# EAGLE design Group11 (EAGLE 9.2.0)
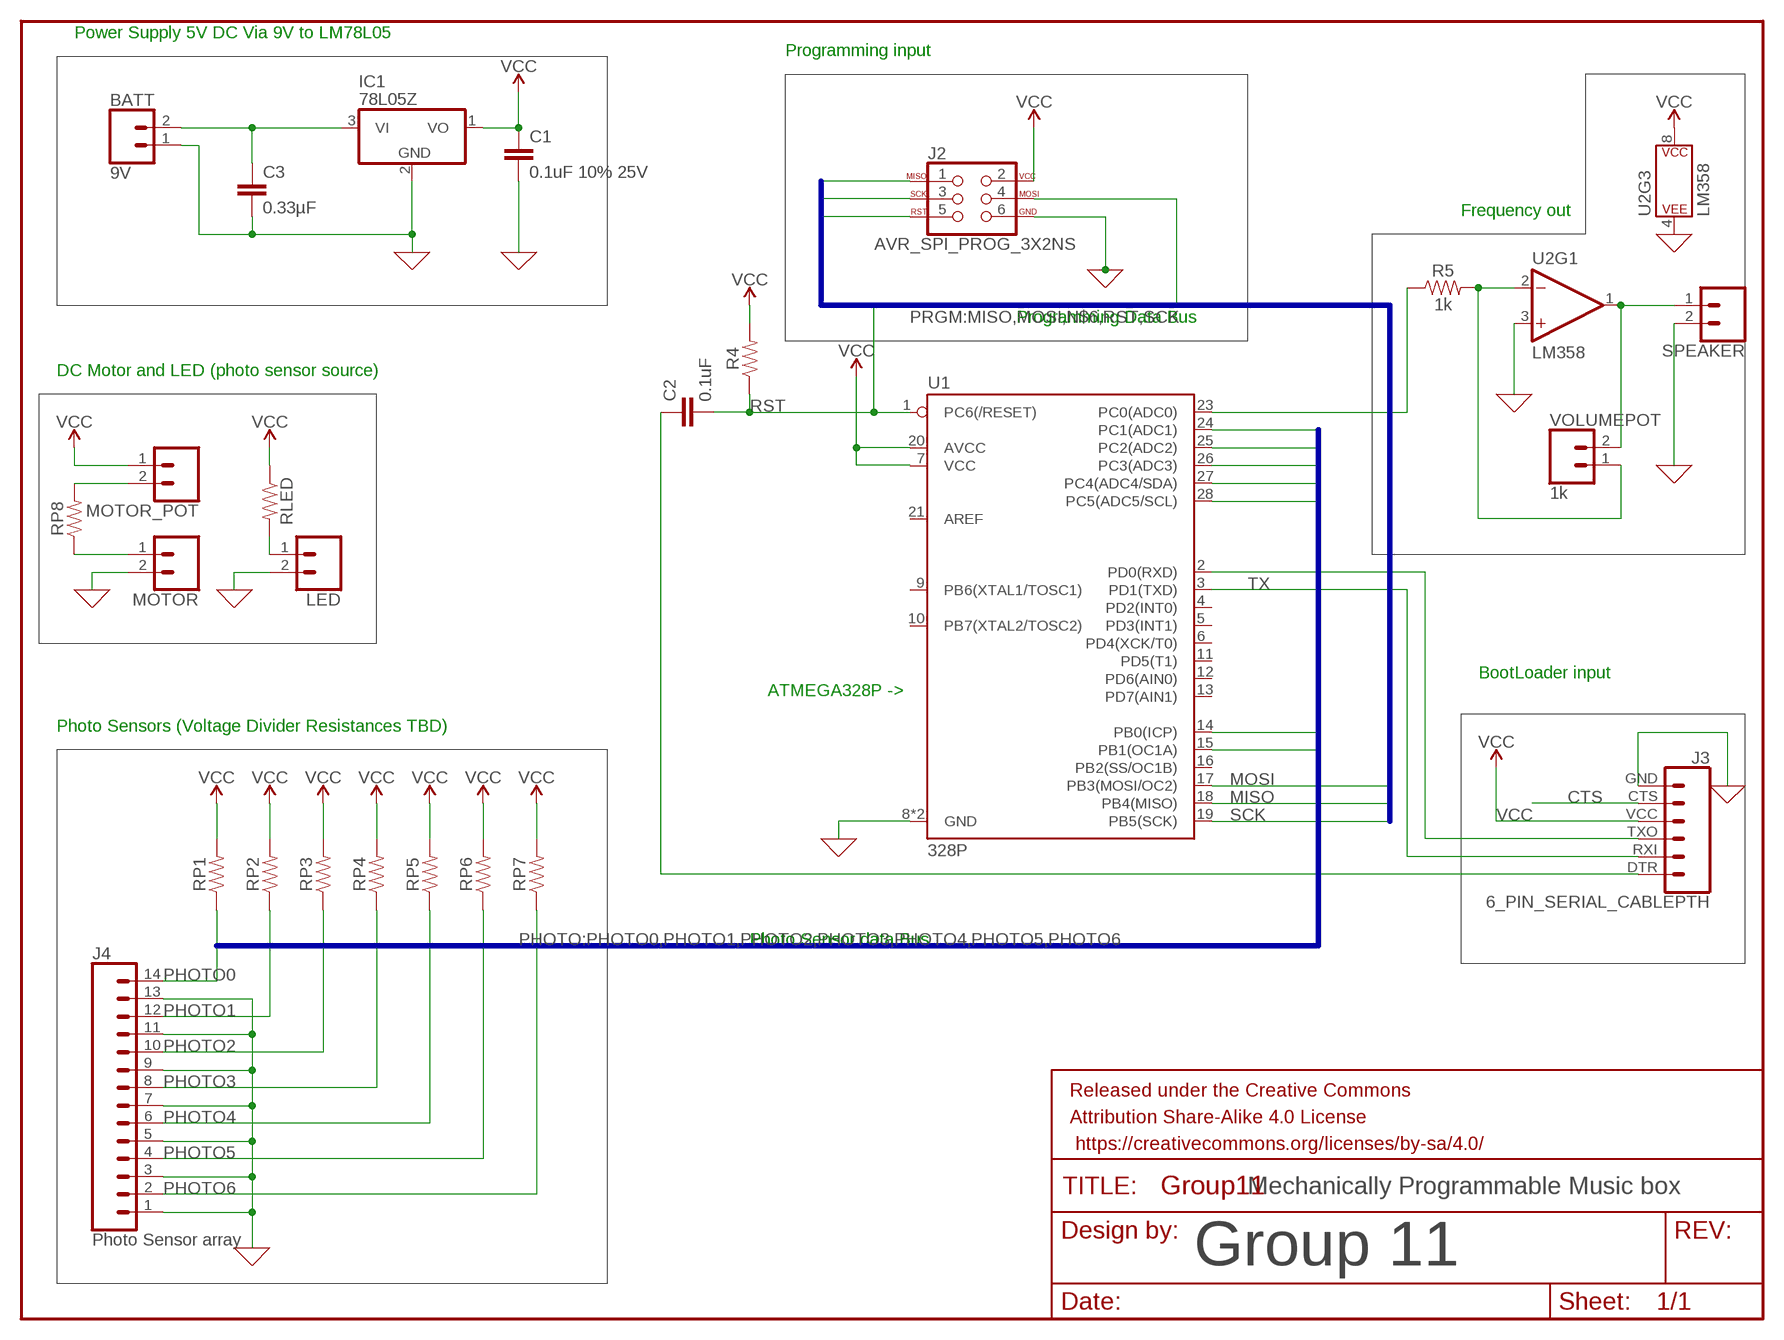
[diagram p0: schematic, sheet 1]

## Parts
BATT  9V  CONN_02  [1X02]
C1  0.1uF 10% 25V  0.1UF-0603-25V-(+80/-20%)  [0603]
C2  0.1uF  0.1UF-0603-25V-(+80/-20%)  [0603]
C3  0.33µF  0.33UF/330NF-0805-50V-10%  [0805]
FRAME1  FRAME-LETTER  [CREATIVE_COMMONS]
IC1  78L05Z  [TO92]
J2  AVR_SPI_PROG_3X2NS  [2X3-NS]
J3  6_PIN_SERIAL_CABLEPTH  [FTDI_BASIC]
J4  Photo Sensor array  CONN_14  [1X14]
LED  CONN_02  [1X02]
MOTOR  CONN_02  [1X02]
MOTOR_POT  CONN_02  [1X02]
R4  RESISTOR0805  [0805]
R5  1k  1KOHM-0603-1/10W-1%  [0603]
RLED  RESISTOR0603  [0603]
RP1  RESISTOR0603  [0603]
RP2  RESISTOR0603  [0603]
RP3  RESISTOR0603  [0603]
RP4  RESISTOR0603  [0603]
RP5  RESISTOR0603  [0603]
RP6  RESISTOR0603  [0603]
RP7  RESISTOR0603  [0603]
RP8  RESISTOR0603  [0603]
SPEAKER  CONN_02  [1X02]
U1  328P  ATMEGA328P_PDIP  [DIP28]
U2  LM358  [DIP08]
VOLUMEPOT  1k  CONN_02  [1X02]

## Nets
0: BATT.1 C1.2 C3.2 IC1.2(GND) J2.6 J3.GND J4.1 J4.3 J4.5 J4.7 J4.9 J4.11 J4.13 LED.2 MOTOR.2 SPEAKER.2 U1.8(GND) U1.22(GND) U2.3(+IN) U2.4(P$V-) ; supply symbol labelled GND
CTS: J3.CTS
MISO: J2.1 U1.18(PB4(MISO))
MOSI: J2.4 U1.17(PB3(MOSI/OC2))
N$1: R5.1 U1.23(PC0(ADC0))
N$2: MOTOR_POT.2 RP8.2
N$3: LED.1 RLED.2
N$4: J3.TXO U1.2(PD0(RXD))
N$5: C2.1 J3.DTR
N$7: MOTOR.1 RP8.1
N$8: R5.2 U2.2(-IN) VOLUMEPOT.1
N$9: SPEAKER.1 U2.1(OUT) VOLUMEPOT.2
N$15: BATT.2 C3.1 IC1.3(VI)
PHOTO0: J4.14 RP1.1 U1.24(PC1(ADC1))
PHOTO1: J4.12 RP2.1 U1.25(PC2(ADC2))
PHOTO2: J4.10 RP3.1 U1.26(PC3(ADC3))
PHOTO3: J4.8 RP4.1 U1.27(PC4(ADC4/SDA))
PHOTO4: J4.6 RP5.1 U1.28(PC5(ADC5/SCL))
PHOTO5: J4.4 RP6.1 U1.14(PB0(ICP))
PHOTO6: J4.2 RP7.1 U1.15(PB1(OC1A))
RST: C2.2 J2.5 R4.1 U1.1(PC6(/RESET))
SCK: J2.3 U1.19(PB5(SCK))
TX: J3.RXI U1.3(PD1(TXD))
VCC: C1.1 IC1.1(VO) J2.2 J3.VCC MOTOR_POT.1 R4.2 RLED.1 RP1.2 RP2.2 RP3.2 RP4.2 RP5.2 RP6.2 RP7.2 U1.7(VCC) U1.20(AVCC) U2.8(P$V+)
Unconnected: U1.4(PD2(INT0)) U1.5(PD3(INT1)) U1.6(PD4(XCK/T0)) U1.9(PB6(XTAL1/TOSC1)) U1.10(PB7(XTAL2/TOSC2)) U1.11(PD5(T1)) U1.12(PD6(AIN0)) U1.13(PD7(AIN1)) U1.16(PB2(SS/OC1B)) U1.21(AREF) U2.5(+IN) U2.6(-IN) U2.7(OUT)

## Buses
PHOTO:PHOTO0,PHOTO1,PHOTO2,PHOTO3,PHOTO4,PHOTO5,PHOTO6
PRGM:MISO,MOSI,N$6,RST,SCK

## Notes on the sheet
- Power Supply 5V DC Via 9V to LM78L05
- Programming input
- Frequency out
- Programming Data Bus
- DC Motor and LED (photo sensor source)
- BootLoader input
- ATMEGA328P ->
- Photo Sensors (Voltage Divider Resistances TBD)
- Photo Sensor data Bus
- Mechanically Programmable Music box
- Group 11

## Library data of the parts
BATT LED MOTOR MOTOR_POT SPEAKER VOLUMEPOT = SparkFun-Connectors:CONN_02: Multi connection point. Often used as Generic Header-pin footprint for 0.1 inch spaced/style header connections On any of the 0.1 inch spaced packages, you can populate with these: Break Away Headers - Straight <https://www.sparkfun.com/products/116> (PRT-00116) Break Away Male Headers - Right Angle <https://www.sparkfun.com/products/553> (PRT-00553) Female Headers <https://www.sparkfun.com/products/115> (PRT-00115) Break Away Headers - Machine Pin <https://www.sparkfun.com/products/117> (PRT-00117) Break Away Female Headers - Swiss Machine Pin <https://www.sparkfun.com/products/743> (PRT-00743) For SCREWTERMINALS and SPRING TERMINALS visit here: Screw Terimnals on SparkFun.com <https://www.sparkfun.com/search/results?term=Screw+Terminals> (5mm/3.5mm/2.54mm spacing) This device is also useful as a general connection point to wire up your design to another part of your project. Our various solder wires solder well into these plated through hole pads. Hook-Up Wire - Assortment (Stranded, 22 AWG) <https://www.sparkfun.com/products/11375> (PRT-11375) Hook-Up Wire - Assortment (Solid Core, 22 AWG) <https://www.sparkfun.com/products/11367> (PRT-11367) View the entire wire category on our website here <https://www.sparkfun.com/categories/141> Special notes: Molex polarized connector foot print use with: PRT-08233 with associated crimp pins and housings. 2.54_SCREWTERM for use with PRT-10571. 3.5mm Screw Terminal footprints for PRT-08084 5mm Screw Terminal footprints for use with PRT-08432
C1 = SparkFun-Capacitors:0.1UF: 0.1µF ceramic capacitors A capacitor is a passive two-terminal electrical component used to store electrical energy temporarily in an electric field.; PROD_ID: CAP-00810; VALUE: 0.1uF
C2 = SparkFun-Capacitors:0.1UF: 0.1µF ceramic capacitors A capacitor is a passive two-terminal electrical component used to store electrical energy temporarily in an electric field.; PROD_ID: CAP-00810
C3 = SparkFun-Capacitors:0.33UF/330NF: 0.33µF/330nF ceramic capacitors A capacitor is a passive two-terminal electrical component used to store electrical energy temporarily in an electric field.; PROD_ID: CAP-08469
FRAME1 = SparkFun-Aesthetics:FRAME-LETTER: Schematic Frame - Letter Standard 8.5x11 US Letter frame
IC1 = linear:78*: Positive VOLTAGE REGULATOR Source: http://cache.national.com/ds/LM/LM78L05.pdf http://www.fairchildsemi.com/ds/LM/LM7805.pdf
J2 = SparkFun-Connectors:AVR_SPI_PROG_3X2: AVR ISP 6 Pin This is the reduced ISP connector for AVR programming. Common on Arduino. This footprint will take up less PCB space and can be used with a 10-pin to 6-pin adapter such as SKU: BOB-08508 **Special note about "TEST_POINT" package. The stop mask is on the top side, so if you want your programming test points to be on the bottom of your board, make sure to place this package on the bottom side of the board. This also ensure that the orientation to program from the bottom side will be correct. SparkFun Products: SparkFun ISP Pogo Adapter <https://www.sparkfun.com/products/11591> - NS Tiny AVR Programmer <https://www.sparkfun.com/products/11801> -PTH
J3 = SparkFun-Connectors:6_PIN_SERIAL_CABLE: 6-pin header connection for use with the "FTDI BASIC" pinout - CABLE SIDE. Also known as "Arduino Serial Program Header". This is used on a design to provide a 6-pin connection point for serial communication usually from a USB cable (D+/D-) to these headers (RX/TX). It also has the remaining pins necessary for programming in the Arduino evironment (DTR, GND, and sometimes VCC). Note, this device has "CABLE" in the name. It is intended to be used on a design that usually lives on the end of your USB cable and prvides the converter chip (FTDI232 or FTDI231x) to commnicate serial RX/TX. The "sister" device, named "TARGET" is inteneded to be used on a design that contains a target micro-controller that you wish to program. You can populate with some of these: Female Headers <https://www.sparkfun.com/products/115> (PRT-00115) For reference (or to suit your programming needs) check out these designs: SparkFun FTDI Basic Breakout - 5V <https://www.sparkfun.com/products/9716> (DEV-09716) SparkFun FTDI Basic Breakout - 3.3V <https://www.sparkfun.com/products/9873> (DEV-09873) SparkFun FTDI SmartBasic <https://www.sparkfun.com/products/12935> (DEV-12935) SparkFun Beefy 3 - FTDI Basic Breakout <https://www.sparkfun.com/products/13746> (DEV-13746)
J4 = SparkFun-Connectors:CONN_14: Multi connection point. Often used as Generic Header-pin footprint for 0.1 inch spaced/style header connections On any of the 0.1 inch spaced packages, you can populate with these: Break Away Headers - Straight <https://www.sparkfun.com/products/116> (PRT-00116) Break Away Male Headers - Right Angle <https://www.sparkfun.com/products/553> (PRT-00553) Female Headers <https://www.sparkfun.com/products/115> (PRT-00115) Break Away Headers - Machine Pin <https://www.sparkfun.com/products/117> (PRT-00117) Break Away Female Headers - Swiss Machine Pin <https://www.sparkfun.com/products/743> (PRT-00743) For SCREWTERMINALS and SPRING TERMINALS visit here: Screw Terimnals on SparkFun.com <https://www.sparkfun.com/search/results?term=Screw+Terminals> (5mm/3.5mm/2.54mm spacing) This device is also useful as a general connection point to wire up your design to another part of your project. Our various solder wires solder well into these plated through hole pads. Hook-Up Wire - Assortment (Stranded, 22 AWG) <https://www.sparkfun.com/products/11375> (PRT-11375) Hook-Up Wire - Assortment (Solid Core, 22 AWG) <https://www.sparkfun.com/products/11367> (PRT-11367) View the entire wire category on our website here <https://www.sparkfun.com/categories/141> Special notes: Molex polarized connector foot print use with SKU : PRT-08231 with associated crimp pins and housings. 1MM SMD Version SKU: PRT-10208 NOTES ON THE VARIANTS LOCK and LOCK_LONGPADS... This footprint was designed to help hold the alignment of a through-hole component (i.e. 6-pin header) while soldering it into place. You may notice that each hole has been shifted either up or down by 0.005 of an inch from it's more standard position (which is a perfectly straight line). This slight alteration caused the pins (the squares in the middle) to touch the edges of the holes. Because they are alternating, it causes a "brace" to hold the component in place. 0.005 has proven to be the perfect amount of "off-center" position when using our standard breakaway headers. Although looks a little odd when you look at the bare footprint, once you have a header in there, the alteration is very hard to notice. Also,if you push a header all the way into place, it is covered up entirely on the bottom side.
R4 RLED RP1-RP8 = SparkFun-Resistors:RESISTOR: Generic Resistor Package
R5 = SparkFun-Resistors:1KOHM: 1kΩ resistor A resistor is a passive two-terminal electrical component that implements electrical resistance as a circuit element. Resistors act to reduce current flow, and, at the same time, act to lower voltage levels within circuits. - Wikipedia; PROD_ID: RES-07856
U1 = SparkFun-IC-Microcontroller:ATMEGA328P_PDIP: Atmel 328P Through hole ATMEGA328P uC used in the Arduino 32kb flash, 1k EEPROM, 2k SRAM Datasheet <http://www.sparkfun.com/datasheets/Components/SMD/ATMega328.pdf> SparkFun Products Storefront component: AVR 28 Pin 20MHz 32K 6A/D - ATMega328P <https://www.sparkfun.com/products/9061> (COM-09061) SparkFun Simon Says - Through-Hole Soldering Kit <https://www.sparkfun.com/products/10547> (KIT-10547) SparkFun Learn to Solder - Simon Says <https://www.sparkfun.com/products/13708> (KIT-13708) SparkFun BigTime Watch Kit <https://www.sparkfun.com/products/11734> (KIT-11734) SparkFun ClockIt <https://www.sparkfun.com/products/10930> (KIT-10930) SparkFun Serial Enabled LCD Kit <https://www.sparkfun.com/products/10097> (LCD-10097) SparkFun Simon Tilts - Through Hole Soldering Kit <https://www.sparkfun.com/products/12634> (KIT-12634) SparkFun Frequency Counter Kit <https://www.sparkfun.com/products/10140> (KIT-10140) FabFM Radio Kit <https://www.sparkfun.com/products/11043> (KIT-11043) SparkFun Binary Blaster Kit <https://www.sparkfun.com/products/12037> (KIT-12037) SparkFun Metro-Gnome <https://www.sparkfun.com/products/9236> (KIT-09236) ATmega328 with Arduino Optiboot (Uno) <https://www.sparkfun.com/products/10524> (DEV-10524); PROD_ID: IC-09136
U2 = SparkFun-IC-Amplifiers:LM358: LM358 Jellybean op-amp Datasheet <http://www.sparkfun.com/datasheets/Components/General/LM358.pdf> SparkFun Products Op-Amp (Thru-Hole) - LM358 <https://www.sparkfun.com/products/9456> (COM-09456); PROD_ID: IC-09172

## Board
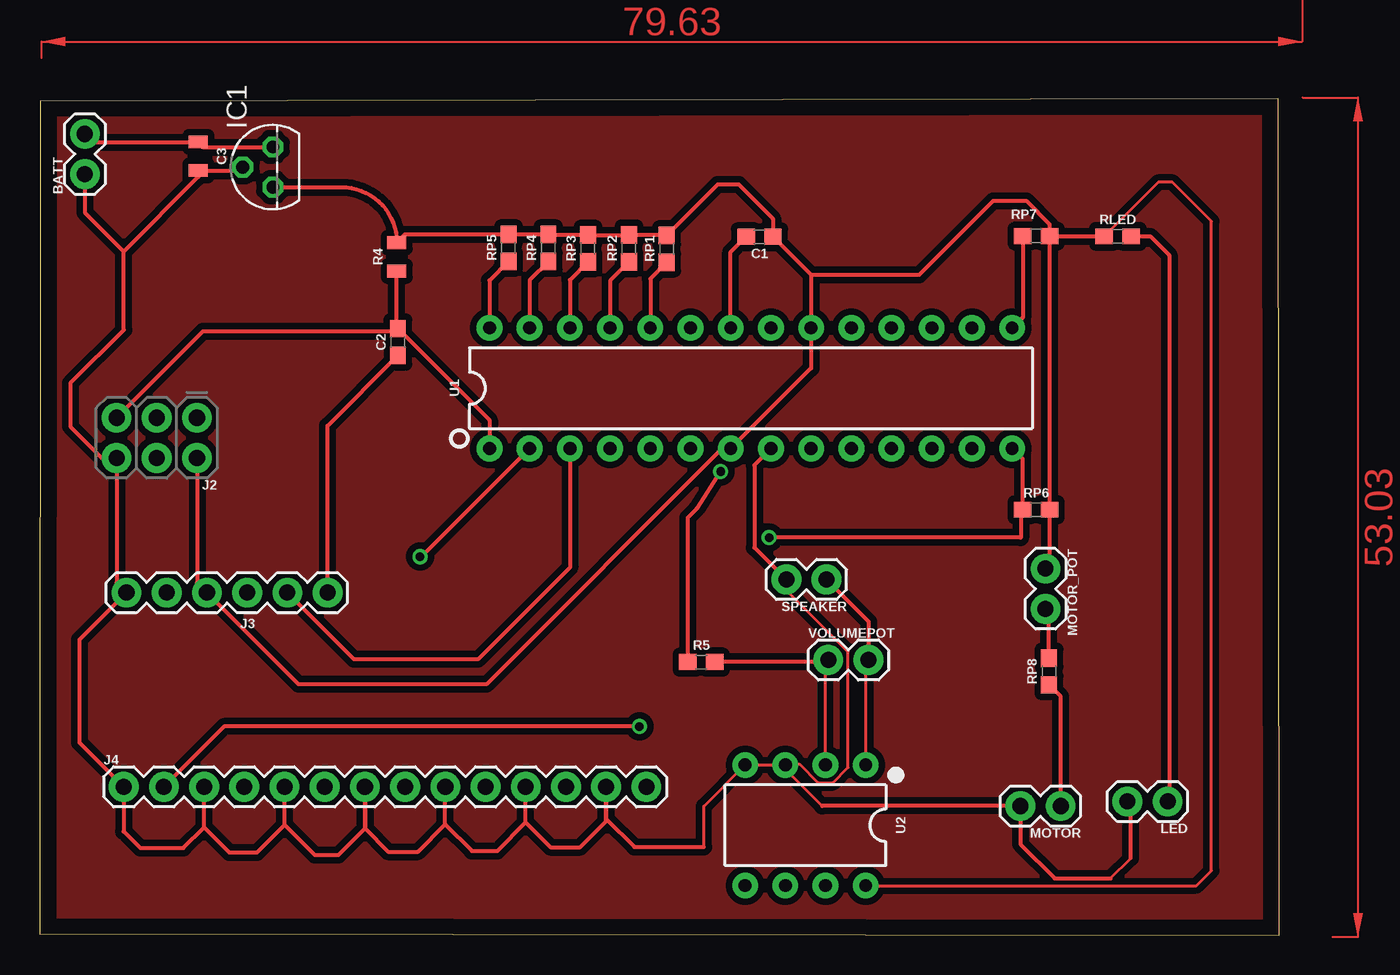
[diagram p1: board, top side]
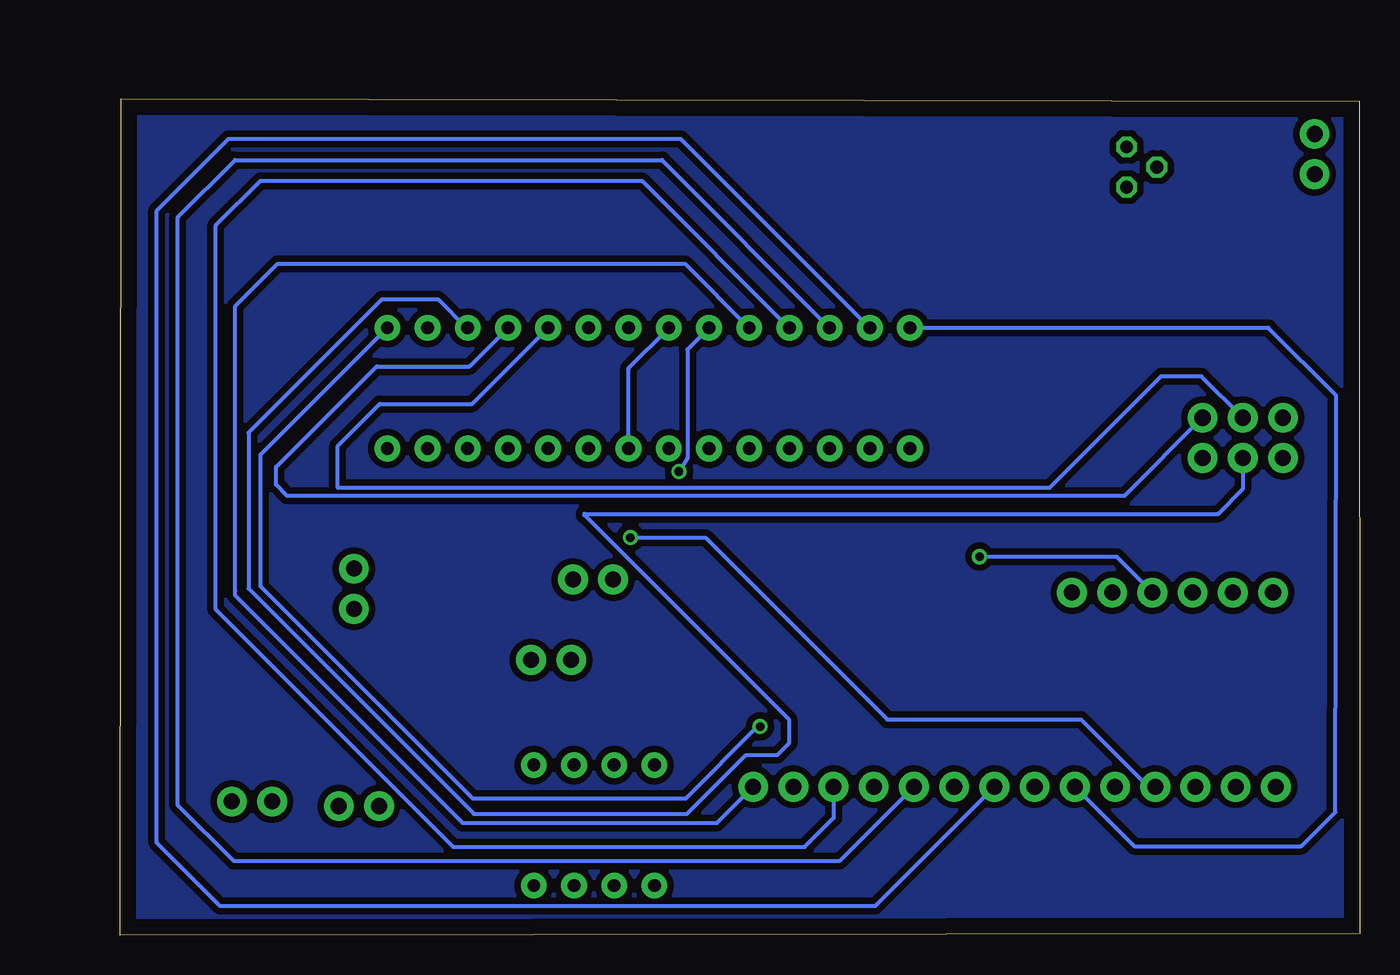
[diagram p2: board, bottom side, seen from below]

Size 78.3 x 52.84 mm. Coordinates in mm from the lower left corner, seen from the top.
Outline: 0,0.09 78.31,0 78.23,52.84 0.01,52.69 0,0.09
Copper layers (1*16): Top 0.035mm / dielectric 1.5mm / Bottom 0.035mm
Design rules "default": minimum track width 6mil, minimum drill 0.35mm, track to track 6mil, track to pad 6mil, pad to pad 6mil, via to via 6mil, smd to smd 6mil, copper to edge 40mil, drill to drill 6mil, minimum pad ring 10mil, minimum via ring 8mil, stop-mask expansion 4mil, vias tented up to drill 0mil, thermal gap 10mil

### Footprints (pad centres in the part's own frame; a part is rotated, then mirrored left to right if it is on the bottom)
1X02 = drill 1.016 pad 1.88: 1 0,0; 2 2.54,0
0603 = smd 1.1 x 1: 1 -0.85,0; 2 0.85,0
0805 = smd 0.8 x 1.2: 1 -0.9,0; 2 0.9,0
TO92 = drill 0.813 octagon: 1 -1.27,0; 2 0,1.905; 3 1.27,0
2X3-NS = drill 1.016 pad 1.88: 1 -2.54,-1.27; 2 -2.54,1.27; 3 0,-1.27; 4 0,1.27; 5 2.54,-1.27; 6 2.54,1.27
FTDI_BASIC = drill 1.016 pad 1.88: CTS 10.16,0; DTR 0,0; GND 12.7,0; RXI 2.54,0; TXO 5.08,0; VCC 7.62,0
1X14 = drill 1.016 pad 1.88: 1 0,0; 2 2.54,0; 3 5.08,0; 4 7.62,0; 5 10.16,0; 6 12.7,0; 7 15.24,0; 8 17.78,0; 9 20.32,0; 10 22.86,0; 11 25.4,0; 12 27.94,0; 13 30.48,0; 14 33.02,0
DIP28 = drill 0.813 pad 1.626: 1 -16.51,-3.81; 2 -13.97,-3.81; 3 -11.43,-3.81; 4 -8.89,-3.81; 5 -6.35,-3.81; 6 -3.81,-3.81; 7 -1.27,-3.81; 8 1.27,-3.81; 9 3.81,-3.81; 10 6.35,-3.81; 11 8.89,-3.81; 12 11.43,-3.81; 13 13.97,-3.81; 14 16.51,-3.81; 15 16.51,3.81; 16 13.97,3.81; 17 11.43,3.81; 18 8.89,3.81; 19 6.35,3.81; 20 3.81,3.81; 21 1.27,3.81; 22 -1.27,3.81; 23 -3.81,3.81; 24 -6.35,3.81; 25 -8.89,3.81; 26 -11.43,3.81; 27 -13.97,3.81; 28 -16.51,3.81
DIP08 = drill 0.813 pad 1.626: 1 -3.81,-3.81; 2 -1.27,-3.81; 3 1.27,-3.81; 4 3.81,-3.81; 5 3.81,3.81; 6 1.27,3.81; 7 -1.27,3.81; 8 -3.81,3.81

### Placement (x,y rotation side)
BATT  2.84,48.08 90 top
C1  45.46,44.13 180 top
C2  22.61,37.47 90 top
C3  10,49.21 270 top
FRAME1  -78.34,-8.88 0 top  (outside the outline)
IC1  14.72,48.53 90 top
J2  7.38,31.41 180 top
J3  18.17,21.64 180 top
J4  5.29,9.37 0 top
LED  71.24,8.44 180 top
MOTOR  64.48,8.15 180 top
MOTOR_POT  63.53,23.15 270 top
R4  22.55,42.85 90 top
R5  41.78,17.25 0 top
RLED  68.09,44.15 0 top
RP1  39.59,43.35 90 top
RP2  37.22,43.39 90 top
RP3  34.63,43.39 90 top
RP4  32.12,43.41 90 top
RP5  29.61,43.42 90 top
RP6  62.93,26.87 0 top
RP7  62.93,44.16 0 top
RP8  63.75,16.66 90 top
SPEAKER  49.69,22.46 180 top
U1  44.91,34.55 0 top
U2  48.36,6.94 180 top
VOLUMEPOT  49.8,17.38 0 top

### Tracks (layer width: path | path; a pad name or v marks a point on that pad's centre or on a via)
0
  Top 0.203: 67.63,3.58 68.91,4.86 | 41.94,5.57 41.94,8.14 U2.4 47.01,10.75 | 47.01,10.75 U2.3 47.15,10.81 47.98,10.81 49.17,9.63 50.09,9.63 51.05,10.59 51.05,17.9 47.15,21.79 SPEAKER.2 | 49.42,8.15 47.01,10.56 47.01,10.75
  Top 0.254: 10.37,6.82 9.06,5.51 6.34,5.51 5.29,6.55 J4.1 2.49,12.17 2.49,18.66 J3.GND 4.84,22.27 J2.6 3.91,30.14 1.92,32.14 1.92,34.86 5.3,38.24 5.3,43.19 | 10.37,6.82 J4.3 | 10.37,6.82 11.96,5.23 13.71,5.23 15.45,6.97 | 15.45,6.97 J4.5 | 15.45,6.97 17.36,5.06 18.87,5.06 20.53,6.73 J4.7 20.53,6.73 21.99,5.27 23.88,5.27 25.61,7 | 25.61,7 J4.9 | 25.61,7 27.29,5.32 28.9,5.32 30.69,7.11 | 30.69,7.11 J4.11 | 30.69,7.11 32.25,5.56 34.12,5.56 35.77,7.2 J4.13 35.77,7.36 37.56,5.57 41.94,5.57 | 49.42,8.15 MOTOR.2 61.94,5.74 64.1,3.58 67.63,3.58 | 68.91,4.86 68.91,8.23 LED.2 | SPEAKER.2 45.13,24.49 45.13,29.7 U1.8 | U1.22 43.64,43.16 C1.2 | 5.3,43.19 10,47.9 C3.2 12.6,48.31 IC1.2 | BATT.1 2.84,45.65 5.3,43.19
  Bottom 0.254: U1.8 46.18,35.82 U1.22
MISO
  Bottom 0.254: J2.1 14.85,27.76 67.75,27.76 68.45,28.46 68.45,29.57 62.09,35.93 56.23,35.93 U1.18
MOSI
  Bottom 0.254: U1.17 56.4,38.36 58.21,40.18 61.76,40.18 70.19,31.74 70.19,21.89 55.95,7.65 42.49,7.65 38.76,11.38 36.78,11.38 36.05,12.11 36.05,13.62 48.98,26.54 48.98,26.62 8.94,26.62 7.38,28.17 J2.4
N$1  (via drill 0.55)
  Top 0.254: R5.1 40.93,26.38 41.5,26.96 v43,29.29
  Bottom 0.254: U1.23 42.46,37.01 42.46,30.12 42.97,29.31 v43,29.29
N$2
  Top 0.254: RP8.2 63.75,20.4 MOTOR_POT.2
N$3
  Top 0.254: RLED.2 70.14,44.15 71.33,42.95 71.33,8.53 LED.1
N$4  (via drill 0.55)
  Top 0.254: U1.2 24.11,23.91 v24.01,23.91
  Bottom 0.254: v24.01,23.91 15.36,23.91 J3.TXO
N$5
  Top 0.254: J3.DTR 18.17,32.18 C2.1
N$7
  Top 0.254: MOTOR.1 64.48,15.07 RP8.1
N$8
  Top 0.203: U2.2 49.63,17.21 VOLUMEPOT.1
  Top 0.254: VOLUMEPOT.1 49.67,17.25 R5.2
N$9
  Top 0.203: U2.1 52.17,17.21 VOLUMEPOT.2
  Top 0.254: VOLUMEPOT.2 52.34,19.82 SPEAKER.1
N$15
  Top 0.254: BATT.2 arc90 3.35,50.11 C3.1 arc90 10.32,49.8 IC1.3
NET:0
  pour Bottom (isolate 0.406): 0.25,52.53 0.25,0.31 77.75,0.31 77.75,52.48 0.32,52.48
  pour Top (isolate 0.406): 1.1,52.06 1.1,0.42 77.68,0.42 77.68,52.19 1.04,52.19
PHOTO0
  Top 0.254: RP1.1 38.56,41.47 U1.24
  Bottom 0.254: J4.14 40.61,7.07 56.64,7.07 71.02,21.45 71.02,21.75 71.02,39.75 68.35,42.42 42.62,42.42 U1.24
PHOTO1
  Top 0.254: RP2.1 36.02,41.34 U1.25
  Bottom 0.254: J4.12 33.23,7.41 35.07,5.57 57.25,5.57 72.25,20.57 72.25,44.85 69.43,47.66 45.34,47.66 36.04,38.36 U1.25
PHOTO2
  Top 0.254: RP3.1 33.48,41.39 U1.26
  Bottom 0.254: J4.10 32.86,4.66 71.11,4.66 74.66,8.21 74.66,45.35 71.03,48.97 44.04,48.97 44.04,48.92 U1.26
PHOTO3
  Top 0.254: RP4.1 30.94,41.38 U1.27
  Bottom 0.254: J4.8 30.62,1.83 71.96,1.83 75.98,5.85 75.98,5.86 75.98,45.79 71.45,50.31 42.89,50.31 U1.27
PHOTO4
  Top 0.254: RP5.1 28.4,41.37 U1.28
  Bottom 0.254: J4.6 14.23,5.61 3.69,5.61 1.53,7.77 1.48,34.08 5.76,38.36 U1.28
PHOTO5  (via drill 0.55)
  Top 0.254: U1.14 62.08,30.08 RP6.1 61.96,26.87 61.96,25.11 v46.07,25.11
  Bottom 0.254: v46.07,25.11 41.34,25.11 29.84,13.61 17.59,13.61 13.35,9.37 J4.4
PHOTO6  (via drill 0.55)
  Top 0.254: RP7.1 62.08,39.03 U1.15 | J4.2 11.64,13.18 v37.87,13.18
  Bottom 0.254: v37.87,13.18 38.02,13.18 42.59,8.62 56.01,8.62 69.42,22.03 69.42,30.36 U1.15
RST
  Top 0.254: 22.78,38.15 C2.2 22.55,38.38 R4.1 | 22.78,38.15 28.4,32.53 U1.1 | J2.5 10.31,38.15 22.78,38.15
SCK
  Bottom 0.254: J2.3 10,35.3 12.54,35.3 19.57,28.27 64.55,28.27 64.55,30.91 61.9,33.56 56.07,33.56 U1.19
TX
  Top 0.254: U1.3 33.48,23.22 27.68,17.42 19.85,17.42 J3.RXI
VCC
  Top 0.203: U2.8 73.06,3.13 74,4.08 74,45.1 71.55,47.56 70.65,47.56 RLED.1
  Top 0.254: 48.72,41.72 C1.1 46.31,45.26 44.13,47.43 42.82,47.43 RP1.2 39.55,44.24 RP2.2 RP3.2 34.6,44.26 RP4.2 32.11,44.27 RP5.2 23.07,44.27 R4.2 arc90 19.04,47.26 IC1.1 | 48.72,41.72 U1.20 48.72,35.82 U1.7 43.1,30.74 28.2,15.85 16.34,15.85 J3.VCC 9.92,22.27 J2.2 | 48.72,41.72 55.55,41.72 60.22,46.39 62.31,46.39 63.78,44.92 RP7.2 | RP7.2 63.79,44.15 RLED.1 | RP7.2 RP6.2 63.78,23.41 MOTOR_POT.1
(copper drawn outside any net)
  shapes: Top area x2